# EasyEDA schematic PowerIO-Display.json
TITLE: Sheet_1; REV: 1.0; Date: 2025-05-29; Sheet: 1/1; Drawn By: Unknownmephi; Company: Your Company
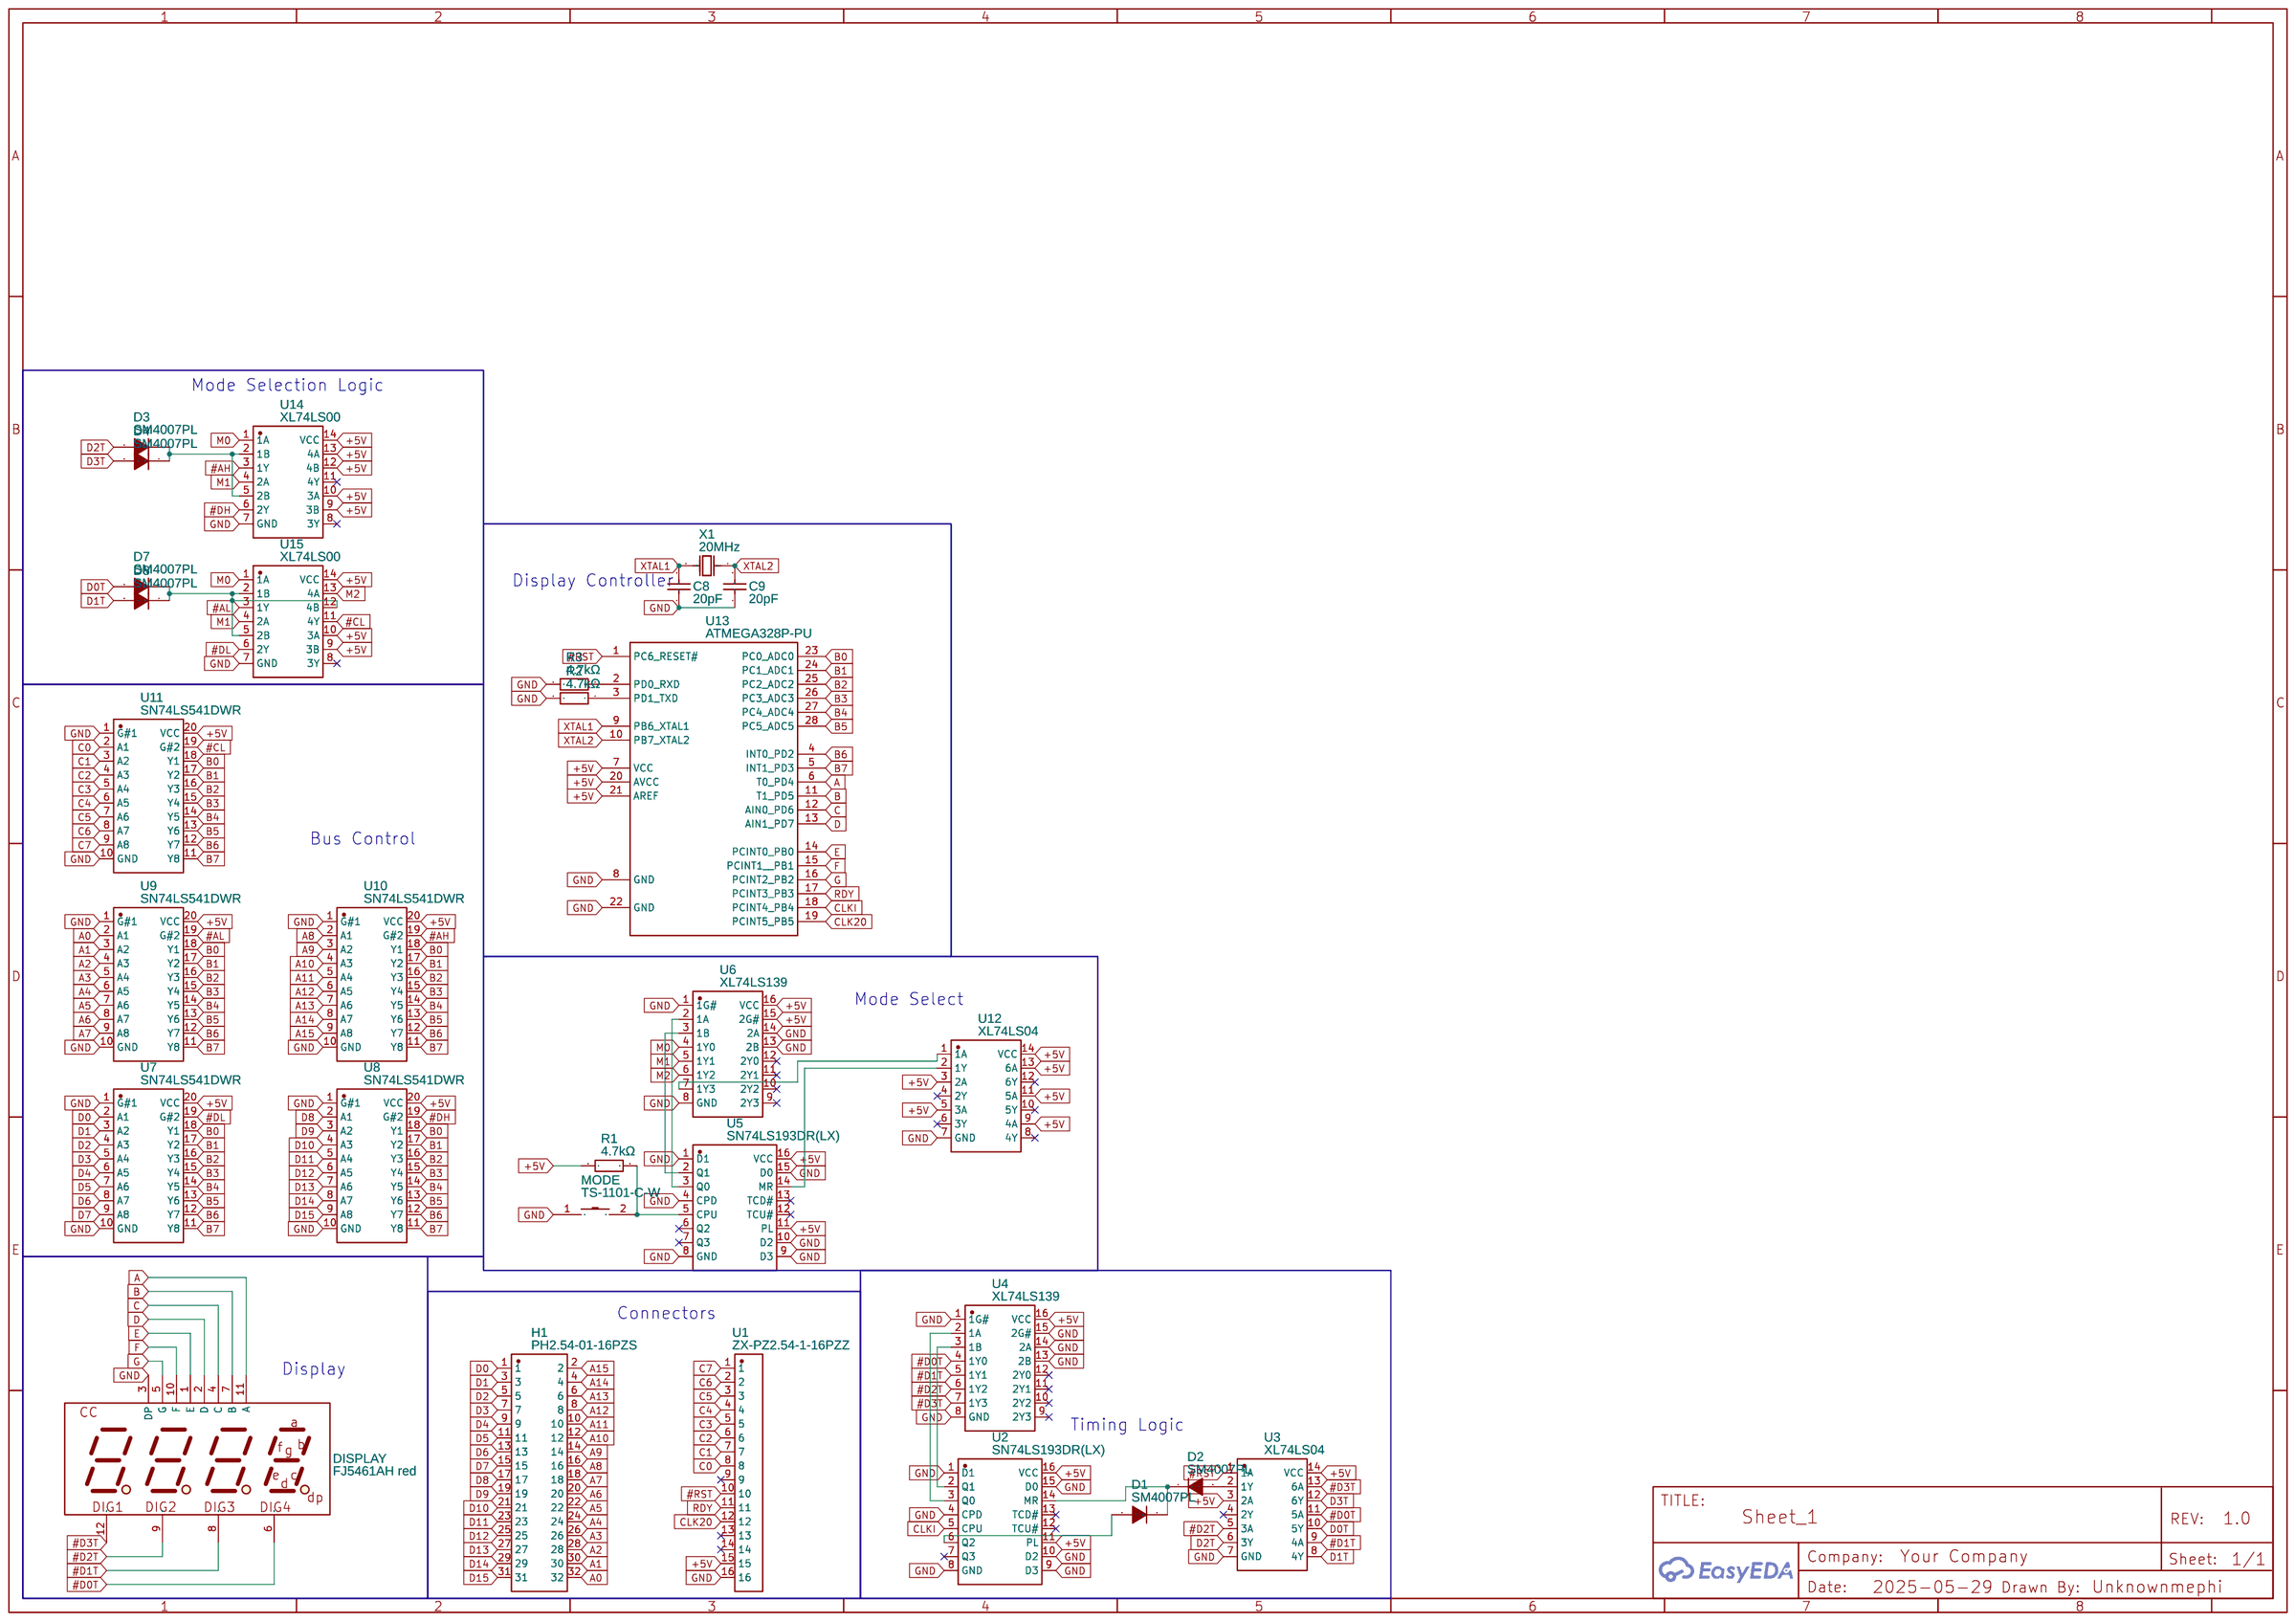
[diagram p0: schematic sheet]

## Parts
C8  20pF  [CAP-TH_L5.0-W3.2-P5.08-D0.6]
C9  20pF  [CAP-TH_L5.0-W3.2-P5.08-D0.6]
D1  SM4007PL  [SOD-123F_L2.8-W1.8-LS3.7-RD]
D2  SM4007PL  [SOD-123F_L2.8-W1.8-LS3.7-RD]
D3  SM4007PL  [SOD-123F_L2.8-W1.8-LS3.7-RD]
D4  SM4007PL  [SOD-123F_L2.8-W1.8-LS3.7-RD]
D7  SM4007PL  [SOD-123F_L2.8-W1.8-LS3.7-RD]
D8  SM4007PL  [SOD-123F_L2.8-W1.8-LS3.7-RD]
DISPLAY  FJ5461AH red  [LED-SEG-TH_FJ5461AH]
H1  PH2.54-01-16PZS  [HDR-TH_32P-P2.54-V-M-R2-C16-S2.54]
MODE  TS-1101-C-W  [SW-SMD_L6.0-W3.3-LS8.0]
R1  4.7kΩ  [R0805]
R2  4.7kΩ  [R0805]
R3  4.7kΩ  [R0805]
U1  ZX-PZ2.54-1-16PZZ  [HDR-TH_16P-P2.54-V-M-2]
U2  SN74LS193DR(LX)  [SOP-16_L9.9-W3.9-P1.27-LS6.0-BL]
U3  XL74LS04  [SOP-14_L8.6-W3.9-P1.27-LS6.0-BL]
U4  XL74LS139  [SOP-16_L9.9-W3.9-P1.27-LS6.1-BL]
U5  SN74LS193DR(LX)  [SOP-16_L9.9-W3.9-P1.27-LS6.0-BL]
U6  XL74LS139  [SOP-16_L9.9-W3.9-P1.27-LS6.1-BL]
U7  SN74LS541DWR  [SOIC-20_L12.8-W7.5-P1.27-LS10.3-BL]
U8  SN74LS541DWR  [SOIC-20_L12.8-W7.5-P1.27-LS10.3-BL]
U9  SN74LS541DWR  [SOIC-20_L12.8-W7.5-P1.27-LS10.3-BL]
U10  SN74LS541DWR  [SOIC-20_L12.8-W7.5-P1.27-LS10.3-BL]
U11  SN74LS541DWR  [SOIC-20_L12.8-W7.5-P1.27-LS10.3-BL]
U12  XL74LS04  [SOP-14_L8.6-W3.9-P1.27-LS6.0-BL]
U13  ATMEGA328P-PU  [DIP-28_L34.6-W7.3-P2.54-LS10.2-BL]
U14  XL74LS00  [SOP-14_L8.6-W3.9-P1.27-LS6.0-BL]
U15  XL74LS00  [SOP-14_L8.6-W3.9-P1.27-LS6.0-BL]
X1  20MHz  [HC-49S_L11.4-W4.8-LS12.7]

## Library data of the parts
C8 C9 = CD1H200JC9BECHD100: Contributor: lcsc; Supplier: LCSC; Supplier Part: C2761744; Manufacturer: Dersonic(德尔创); JLCPCB Part Class: Extended Part
D1-D4 D7 D8 = SM4007PL: Supplier: LCSC; Manufacturer: MDD(辰达半导体); Supplier Part: C64898; JLCPCB Part Class: Basic Part
DISPLAY = FJ5461AH red: Supplier: LCSC; Manufacturer: 志浩; Manufacturer Part: FJ5461AH 红色; Supplier Part: C54396; JLCPCB Part Class: Extended Part
H1 = PH2.54-01-16PZS: Supplier: LCSC; Supplier Part: C7501602; Manufacturer: XUNPU(讯普); Contributor: lcsc; JLCPCB Part Class: Extended Part
MODE = TS-1101-C-W: Contributor: LCSC; Supplier: LCSC; Supplier Part: C318938; Manufacturer: XKB Connectivity(中国星坤); JLCPCB Part Class: Extended Part
R1-R3 = 0805W8F4701T5E: Supplier: LCSC; Manufacturer: UNI-ROYAL(厚声); Supplier Part: C17673; JLCPCB Part Class: Basic Part
U1 = ZX-PZ2.54-1-16PZZ: Supplier: LCSC; Supplier Part: C7501270; Manufacturer: Megastar(兆星); Contributor: lcsc; JLCPCB Part Class: Extended Part
U2 U5 = SN74LS193DR(LX): Supplier: LCSC; Supplier Part: C22449630; Manufacturer: LX(灵星芯微); Contributor: lcsc; JLCPCB Part Class: Extended Part
U3 U12 = XL74LS04: Contributor: LCSC; Supplier: LCSC; Supplier Part: C513511; Manufacturer: XINLUDA(信路达); JLCPCB Part Class: Extended Part
U4 U6 = XL74LS139: Contributor: LCSC; Supplier: LCSC; Supplier Part: C521174; Manufacturer: XINLUDA(信路达); JLCPCB Part Class: Extended Part
U7-U11 = SN74LS541DWR: Contributor: LCSC; Supplier: LCSC; Supplier Part: C2675558; Manufacturer: TI(德州仪器); JLCPCB Part Class: Extended Part
U13 = ATMEGA328P-PU: sourceId: Oic6oiASL; Contributor: LCSC; Supplier: LCSC; Manufacturer: MICROCHIP(美国微芯); Supplier Part: C33901; JLCPCB Part Class: Extended Part
U14 U15 = XL74LS00: Contributor: LCSC; Supplier: LCSC; Supplier Part: C609793; Manufacturer: XINLUDA(信路达); JLCPCB Part Class: Extended Part
X1 = H6OEL89CSC-SUGYLC-20M: Supplier: LCSC; Supplier Part: C18213020; Manufacturer: YXC(扬兴晶振); Contributor: lcsc; JLCPCB Part Class: Extended Part

## Nets
+5V: R1.1 U1.15 U2.11(PL) U2.16(VCC) U3.3(2A) U3.14(VCC) U4.16(VCC) U5.11(PL) U5.16(VCC) U6.15(2G#) U6.16(VCC) U7.20(VCC) U8.20(VCC) U9.20(VCC) U10.20(VCC) U11.20(VCC) U12.3(2A) U12.5(3A) U12.9(4A) U12.11(5A) U12.13(6A) U12.14(VCC) U13.7(VCC) U13.20(AVCC) U13.21(AREF) U14.9(3B) U14.10(3A) U14.12(4B) U14.13(4A) U14.14(VCC) U15.9(3B) U15.10(3A) U15.14(VCC)
GND: C8.1 C9.1 DISPLAY.3(DP) MODE.1 R2.2 R3.2 U1.16 U2.1(D1) U2.4(CPD) U2.8(GND) U2.9(D3) U2.10(D2) U2.15(D0) U3.7(GND) U4.1(1G#) U4.8(GND) U4.13(2B) U4.14(2A) U4.15(2G#) U5.1(D1) U5.4(CPD) U5.8(GND) U5.9(D3) U5.10(D2) U5.15(D0) U6.1(1G#) U6.8(GND) U6.13(2B) U6.14(2A) U7.1(G#1) U7.10(GND) U8.1(G#1) U8.10(GND) U9.1(G#1) U9.10(GND) U10.1(G#1) U10.10(GND) U11.1(G#1) U11.10(GND) U12.7(GND) U13.8(GND) U13.22(GND) U14.7(GND) U15.7(GND)
#AH: U10.19(G#2) U14.3(1Y)
#AL: U9.19(G#2) U15.3(1Y)
#CL: U11.19(G#2) U15.11(4Y)
#D0T: DISPLAY.6(DIG4) U3.11(5A) U4.4(1Y0)
#D1T: DISPLAY.8(DIG3) U3.9(4A) U4.5(1Y1)
#D2T: DISPLAY.9(DIG2) U3.5(3A) U4.6(1Y2)
#D3T: DISPLAY.12(DIG1) U3.13(6A) U4.7(1Y3)
#DH: U8.19(G#2) U14.6(2Y)
#DL: U7.19(G#2) U15.6(2Y)
#RST: U1.10 U3.1(1A) U13.1(PC6 RESET#)
A: DISPLAY.11(A) U13.6(T0 PD4)
A0: H1.32 U9.2(A1)
A1: H1.30 U9.3(A2)
A2: H1.28 U9.4(A3)
A3: H1.26 U9.5(A4)
A4: H1.24 U9.6(A5)
A5: H1.22 U9.7(A6)
A6: H1.20 U9.8(A7)
A7: H1.18 U9.9(A8)
A8: H1.16 U10.2(A1)
A9: H1.14 U10.3(A2)
A10: H1.12 U10.4(A3)
A11: H1.10 U10.5(A4)
A12: H1.8 U10.6(A5)
A13: H1.6 U10.7(A6)
A14: H1.4 U10.8(A7)
A15: H1.2 U10.9(A8)
B: DISPLAY.7(B) U13.11(T1 PD5)
B0: U7.18(Y1) U8.18(Y1) U9.18(Y1) U10.18(Y1) U11.18(Y1) U13.23(PC0 ADC0)
B1: U7.17(Y2) U8.17(Y2) U9.17(Y2) U10.17(Y2) U11.17(Y2) U13.24(PC1 ADC1)
B2: U7.16(Y3) U8.16(Y3) U9.16(Y3) U10.16(Y3) U11.16(Y3) U13.25(PC2 ADC2)
B3: U7.15(Y4) U8.15(Y4) U9.15(Y4) U10.15(Y4) U11.15(Y4) U13.26(PC3 ADC3)
B4: U7.14(Y5) U8.14(Y5) U9.14(Y5) U10.14(Y5) U11.14(Y5) U13.27(PC4 ADC4)
B5: U7.13(Y6) U8.13(Y6) U9.13(Y6) U10.13(Y6) U11.13(Y6) U13.28(PC5 ADC5)
B6: U7.12(Y7) U8.12(Y7) U9.12(Y7) U10.12(Y7) U11.12(Y7) U13.4(INT0 PD2)
B7: U7.11(Y8) U8.11(Y8) U9.11(Y8) U10.11(Y8) U11.11(Y8) U13.5(INT1 PD3)
C: DISPLAY.4(C) U13.12(AIN0 PD6)
C0: U1.8 U11.2(A1)
C1: U1.7 U11.3(A2)
C2: U1.6 U11.4(A3)
C3: U1.5 U11.5(A4)
C4: U1.4 U11.6(A5)
C5: U1.3 U11.7(A6)
C6: U1.2 U11.8(A7)
C7: U1.1 U11.9(A8)
CLK20: U1.12 U13.19(PCINT5 PB5)
CLKI: U2.5(CPU) U13.18(PCINT4 PB4)
D: DISPLAY.2(D) U13.13(AIN1 PD7)
D0: H1.1 U7.2(A1)
D0T: D7.2(A) U3.10(5Y)
D1: H1.3 U7.3(A2)
D1T: D8.2(A) U3.8(4Y)
D2: H1.5 U7.4(A3)
D2T: D3.2(A) U3.6(3Y)
D3: H1.7 U7.5(A4)
D3T: D4.2(A) U3.12(6Y)
D4: H1.9 U7.6(A5)
D5: H1.11 U7.7(A6)
D6: H1.13 U7.8(A7)
D7: H1.15 U7.9(A8)
D8: H1.17 U8.2(A1)
D9: H1.19 U8.3(A2)
D10: H1.21 U8.4(A3)
D11: H1.23 U8.5(A4)
D12: H1.25 U8.6(A5)
D13: H1.27 U8.7(A6)
D14: H1.29 U8.8(A7)
D15: H1.31 U8.9(A8)
E: DISPLAY.1(E) U13.14(PCINT0 PB0)
F: DISPLAY.10(F) U13.15(PCINT1  PB1)
G: DISPLAY.5(G) U13.16(PCINT2 PB2)
M0: U6.4(1Y0) U14.1(1A) U15.1(1A)
M1: U6.5(1Y1) U14.4(2A) U15.4(2A)
M2: U6.6(1Y2) U15.13(4A)
RDY: U1.11 U13.17(PCINT3 PB3)
XTAL1: C8.2 U13.9(PB6 XTAL1) X1.2(OSC2)
XTAL2: C9.2 U13.10(PB7 XTAL2) X1.1(OSC1)
Net-(D1-1): D1.1(C) D2.1(C) U2.14(MR)
Net-(D1-2): D1.2(A) U2.6(Q2)
Net-(D2-2): D2.2(A) U3.2(1Y)
Net-(D3-1): D3.1(C) D4.1(C) U14.2(1B) U14.5(2B)
Net-(D7-1): D7.1(C) D8.1(C) U15.2(1B) U15.5(2B) U15.12(4B)
Net-(MODE-2): MODE.2 R1.2 U5.5(CPU)
Net-(R2-1): R2.1 U13.3(PD1 TXD)
Net-(R3-1): R3.1 U13.2(PD0 RXD)
Net-(U2-2): U2.2(Q1) U4.3(1B)
Net-(U2-3): U2.3(Q0) U4.2(1A)
Net-(U5-2): U5.2(Q1) U6.3(1B)
Net-(U5-3): U5.3(Q0) U6.2(1A)
Net-(U5-14): U5.14(MR) U12.2(1Y)
Net-(U6-7): U6.7(1Y3) U12.1(1A)

Not connected (* = marked no-connect by the designer): U1 9* 13* 14*; U2 7(Q3)* 12(TCU#)* 13(TCD#)*; U3 4(2Y)*; U4 9(2Y3)* 10(2Y2)* 11(2Y1)* 12(2Y0)*; U5 6(Q2)* 7(Q3)* 12(TCU#)* 13(TCD#)*; U6 9(2Y3)* 10(2Y2)* 11(2Y1)* 12(2Y0)*; U12 4(2Y)* 6(3Y)* 8(4Y)* 10(5Y)* 12(6Y)*; U14 8(3Y)* 11(4Y)*; U15 8(3Y)*

## Notes on the sheet
- Mode Selection Logic
- Display Controller
- Bus Control
- Mode Select
- Connectors
- Display
- Timing Logic
